# EAGLE schematic Arduino Micro DRAM Tester 3 (EAGLE 9.5.0)
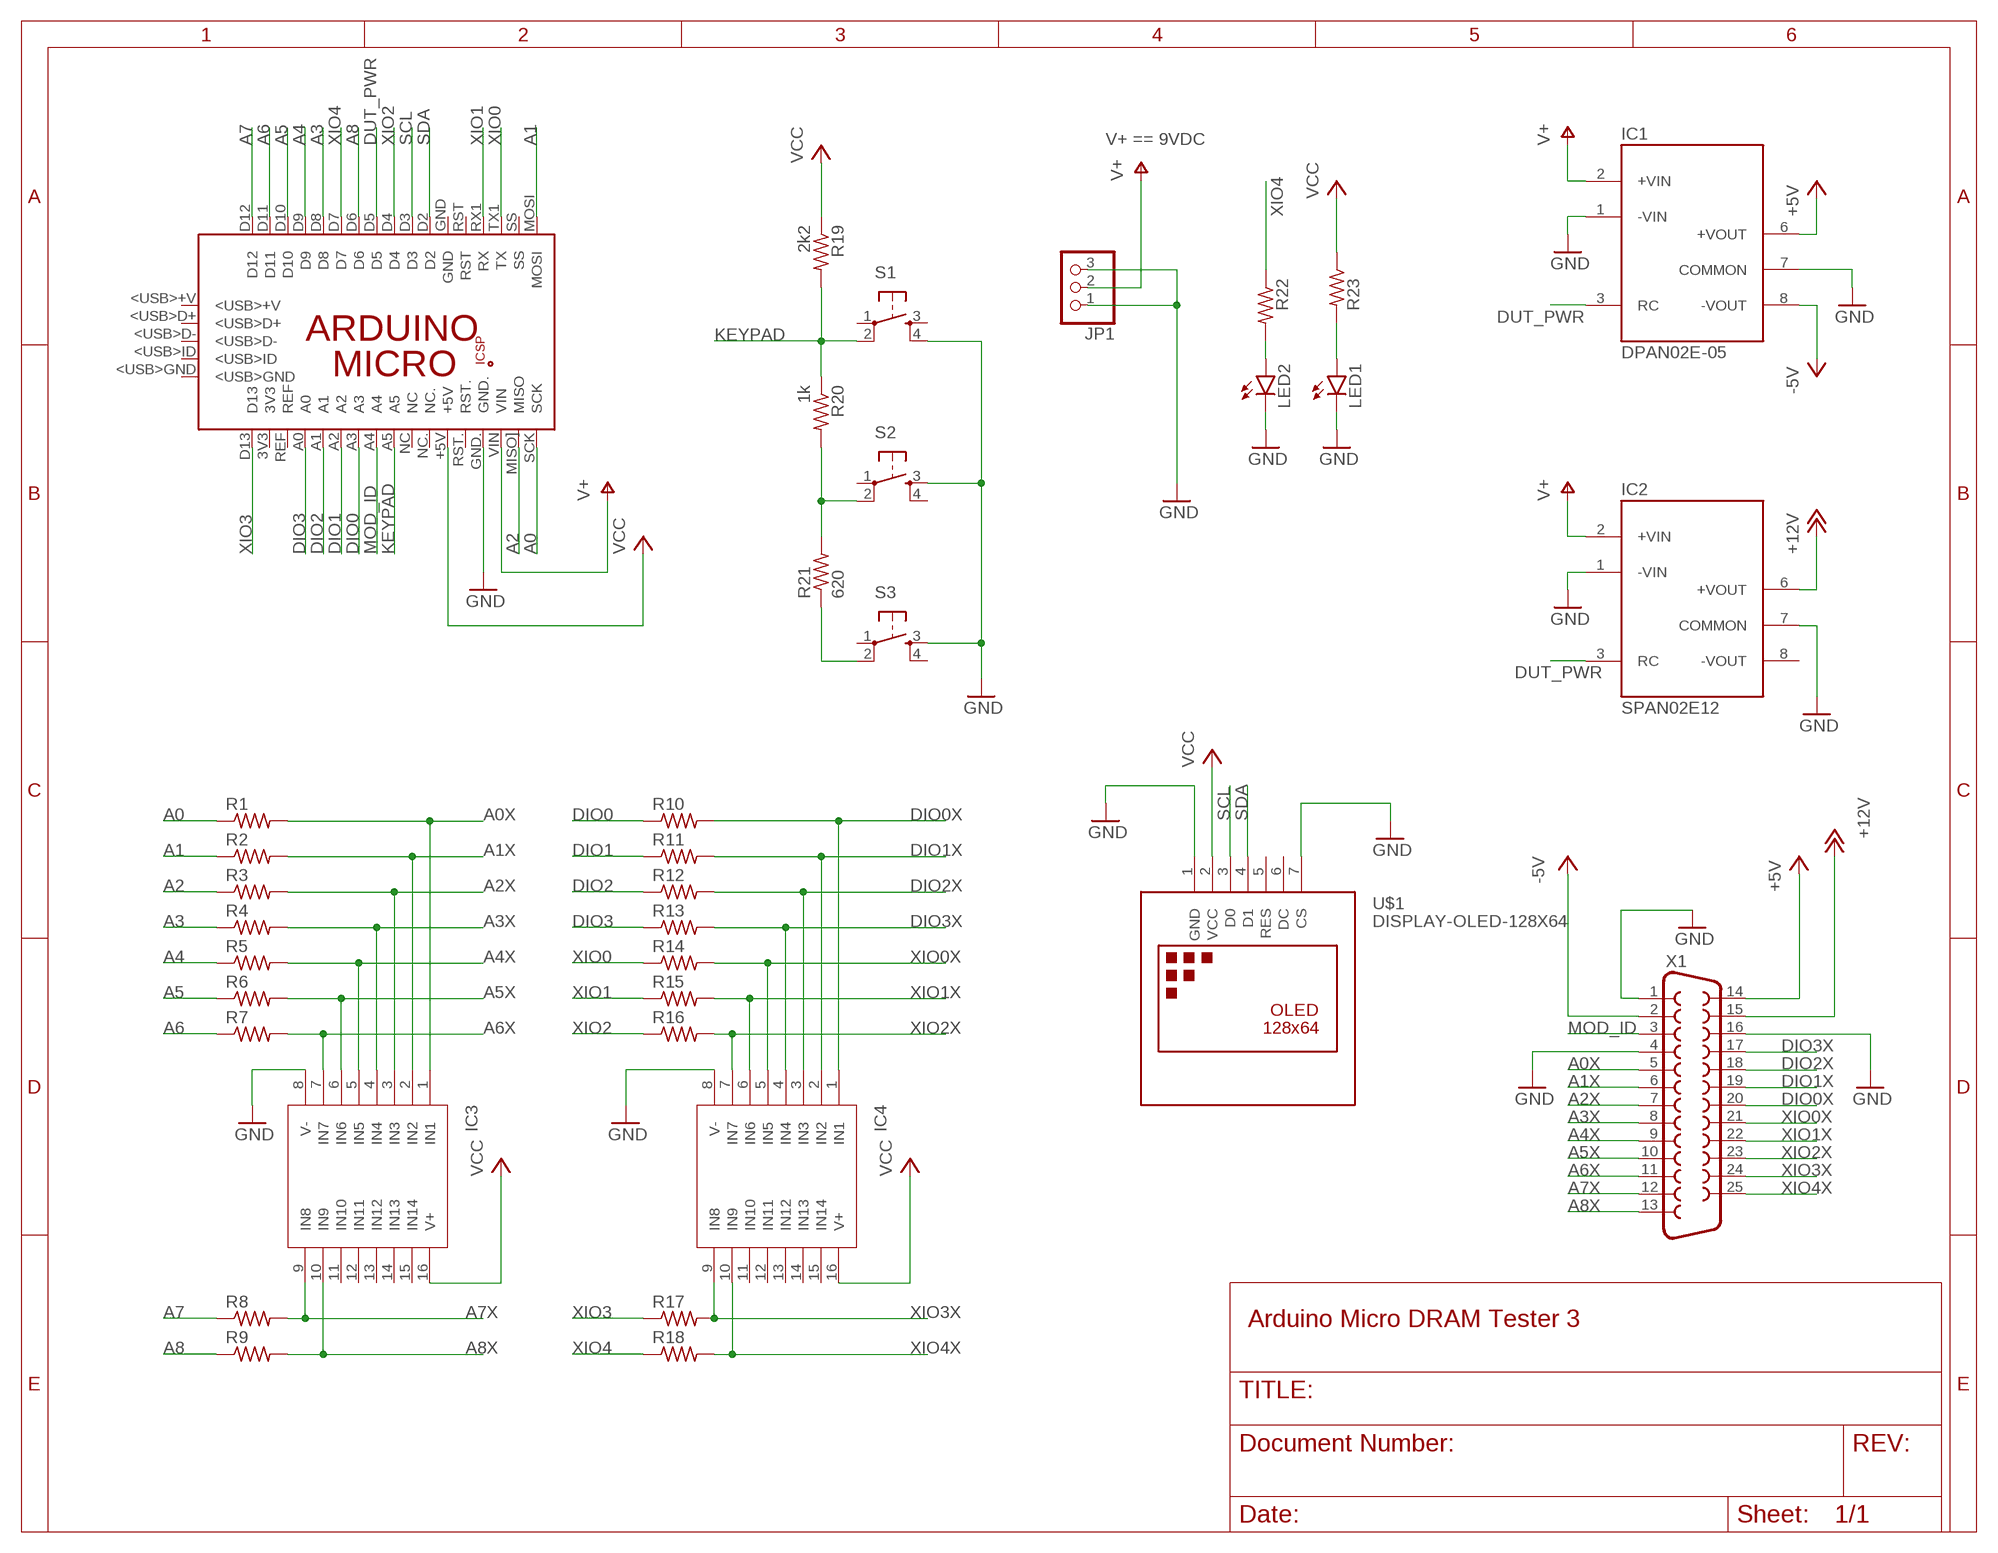
[diagram p0: schematic, sheet 1]

## Parts
IC1  DPAN02E-05  DPAN02  [SIP7]
IC2  SPAN02E12  DPAN02  [SIP7]
IC3  SP720  [DIL16]
IC4  SP720  [DIL16]
JP1  PINHD-1X3/90  [1X03/90]
LED1  LED5MM  [LED5MM]
LED2  LED5MM  [LED5MM]
PCB1  ARDUINO_MICRO  [ARDUINO_MICRO]
R1  R-US_0204/7  [0204/7]
R2  R-US_0204/7  [0204/7]
R3  R-US_0204/7  [0204/7]
R4  R-US_0204/7  [0204/7]
R5  R-US_0204/7  [0204/7]
R6  R-US_0204/7  [0204/7]
R7  R-US_0204/7  [0204/7]
R8  R-US_0204/7  [0204/7]
R9  R-US_0204/7  [0204/7]
R10  R-US_0204/7  [0204/7]
R11  R-US_0204/7  [0204/7]
R12  R-US_0204/7  [0204/7]
R13  R-US_0204/7  [0204/7]
R14  R-US_0204/7  [0204/7]
R15  R-US_0204/7  [0204/7]
R16  R-US_0204/7  [0204/7]
R17  R-US_0204/7  [0204/7]
R18  R-US_0204/7  [0204/7]
R19  2k2  R-US_0204/7  [0204/7]
R20  1k  R-US_0204/7  [0204/7]
R21  620  R-US_0204/7  [0204/7]
R22  R-US_0204/7  [0204/7]
R23  R-US_0204/7  [0204/7]
S1  TAC_SWITCHPTH  [TACTILE-PTH]
S2  TAC_SWITCHPTH  [TACTILE-PTH]
S3  TAC_SWITCHPTH  [TACTILE-PTH]
U$1  DISPLAY-OLED-128X64  [DISPLAY-OLED-128X64]
X1  F25D  [F25D]

## Nets
+5V: IC1.6(+VOUT) X1.14
+12V: IC2.6(+VOUT) X1.15
-5V: IC1.8(-VOUT) X1.2
A0: PCB1.SCK R1.1
A0X: IC3.1(IN1) R1.2 X1.5
A1: PCB1.MOSI R2.1
A1X: IC3.2(IN2) R2.2 X1.6
A2: PCB1.MISO](MISO) R3.1
A2X: IC3.3(IN3) R3.2 X1.7
A3: PCB1.D8 R4.1
A3X: IC3.4(IN4) R4.2 X1.8
A4: PCB1.D9 R5.1
A4X: IC3.5(IN5) R5.2 X1.9
A5: PCB1.D10 R6.1
A5X: IC3.6(IN6) R6.2 X1.10
A6: PCB1.D11 R7.1
A6X: IC3.7(IN7) R7.2 X1.11
A7: PCB1.D12 R8.1
A7X: IC3.9(IN8) R8.2 X1.12
A8: PCB1.D6 R9.1
A8X: IC3.10(IN9) R9.2 X1.13
DIO0: PCB1.A3 R10.1
DIO0X: IC4.1(IN1) R10.2 X1.20
DIO1: PCB1.A2 R11.1
DIO1X: IC4.2(IN2) R11.2 X1.19
DIO2: PCB1.A1 R12.1
DIO2X: IC4.3(IN3) R12.2 X1.18
DIO3: PCB1.A0 R13.1
DIO3X: IC4.4(IN4) R13.2 X1.17
DUT_PWR: IC1.3(RC) IC2.3(RC) PCB1.D5
GND: IC1.1(-VIN) IC1.7(COMMON) IC2.1(-VIN) IC2.7(COMMON) IC3.8(V-) IC4.8(V-) JP1.1 JP1.3 LED1.K(C) LED2.K(C) PCB1.GND. S1.4 S2.3 S3.3 U$1.1(GND) U$1.7(CS) X1.16
KEYPAD: PCB1.A5 R19.2 R20.1 S1.2
MOD_ID: PCB1.A4 X1.3
N$1: X1.1 ; supply symbol labelled GND
N$2: R20.2 R21.2 S2.2
N$3: R21.1 S3.2
N$6: LED1.A R23.2
N$7: X1.4 ; supply symbol labelled GND
N$20: LED2.A R22.2
SCL: PCB1.D3 U$1.3(D0)
SDA: PCB1.D2 U$1.4(D1)
V+: IC1.2(+VIN) IC2.2(+VIN) JP1.2 PCB1.VIN
VCC: IC3.16(V+) IC4.16(V+) PCB1.+5V R19.1 R23.1 U$1.2(VCC)
XIO0: PCB1.TX1(TX) R14.1
XIO0X: IC4.5(IN5) R14.2 X1.21
XIO1: PCB1.RX1(RX) R15.1
XIO1X: IC4.6(IN6) R15.2 X1.22
XIO2: PCB1.D4 R16.1
XIO2X: IC4.7(IN7) R16.2 X1.23
XIO3: PCB1.D13 R17.1
XIO3X: IC4.9(IN8) R17.2 X1.24
XIO4: PCB1.D7 R18.1 R22.1
XIO4X: IC4.10(IN9) R18.2 X1.25
Unconnected: IC2.8(-VOUT) IC3.11(IN10) IC3.12(IN11) IC3.13(IN12) IC3.14(IN13) IC3.15(IN14) IC4.11(IN10) IC4.12(IN11) IC4.13(IN12) IC4.14(IN13) IC4.15(IN14) PCB1.3V3 PCB1.5V PCB1.<USB>+V PCB1.<USB>D+ PCB1.<USB>D- PCB1.<USB>GND PCB1.<USB>ID PCB1.GND PCB1.GND_ PCB1.MISO. PCB1.MOSI. PCB1.NC PCB1.NC. PCB1.REF PCB1.RESET.. PCB1.RST PCB1.RST. PCB1.SCK. PCB1.SS S1.1 S1.3 S2.1 S2.4 S3.1 S3.4 U$1.5(RES) U$1.6(DC)

## Notes on the sheet
- V+ == 9VDC

## Library data of the parts
IC1 IC2 = MW DPAN02:DPAN02
IC3 IC4 = Littlefuse:SP720
JP1 = pinhead:PINHD-1X3: PIN HEADER
LED1 LED2 = led:LED: LED OSRAM: - CHIPLED LG R971, LG N971, LY N971, LG Q971, LY Q971, LO R971, LY R971 LH N974, LH R974 LS Q976, LO Q976, LY Q976 LO Q996 - Hyper CHIPLED LW Q18S LB Q993, LB Q99A, LB R99A - SideLED LS A670, LO A670, LY A670, LG A670, LP A670 LB A673, LV A673, LT A673, LW A673 LH A674 LY A675 LS A676, LA A676, LO A676, LY A676, LW A676 LS A679, LY A679, LG A679 - Hyper Micro SIDELED® LS Y876, LA Y876, LO Y876, LY Y876 LT Y87S - SmartLED LW L88C, LW L88S LB L89C, LB L89S, LG L890 LS L89K, LO L89K, LY L89K LS L896, LA L896, LO L896, LY L896 - TOPLED LS T670, LO T670, LY T670, LG T670, LP T670 LSG T670, LSP T670, LSY T670, LOP T670, LYG T670 LG T671, LOG T671, LSG T671 LB T673, LV T673, LT T673, LW T673 LH T674 LS T676, LA T676, LO T676, LY T676, LB T676, LH T676, LSB T676, LW T676 LB T67C, LV T67C, LT T67C, LS T67K, LO T67K, LY T67K, LW E67C LS E67B, LA E67B, LO E67B, LY E67B, LB E67C, LV E67C, LT E67C LW T67C LS T679, LY T679, LG T679 LS T770, LO T770, LY T770, LG T770, LP T770 LB T773, LV T773, LT T773, LW T773 LH T774 LS E675, LA E675, LY E675, LS T675 LS T776, LA T776, LO T776, LY T776, LB T776 LHGB T686 LT T68C, LB T68C - Hyper Mini TOPLED® LB M676 - Mini TOPLED Santana® LG M470 LS M47K, LO M47K, LY M47K Source: http://www.osram.convergy.de LUXEON: - LUMILED® LXK2-PW12-R00, LXK2-PW12-S00, LXK2-PW14-U00, LXK2-PW14-V00 LXK2-PM12-R00, LXK2-PM12-S00, LXK2-PM14-U00 LXK2-PE12-Q00, LXK2-PE12-R00, LXK2-PE12-S00, LXK2-PE14-T00, LXK2-PE14-U00 LXK2-PB12-K00, LXK2-PB12-L00, LXK2-PB12-M00, LXK2-PB14-N00, LXK2-PB14-P00, LXK2-PB14-Q00 LXK2-PR12-L00, LXK2-PR12-M00, LXK2-PR14-Q00, LXK2-PR14-R00 LXK2-PD12-Q00, LXK2-PD12-R00, LXK2-PD12-S00 LXK2-PH12-R00, LXK2-PH12-S00 LXK2-PL12-P00, LXK2-PL12-Q00, LXK2-PL12-R00 Source: www.luxeon.com KINGBRIGHT: KA-3528ASYC Source: www.kingbright.com
PCB1 = E14_Arduino_revC:ARDUINO_MICRO: Device for representing an Arduino Micro board with a footprint in an EAGLE design. Created by Dave Young for Element14. More EAGLE documentation at: http://www.element14.com/community/community/knode/cadsoft_eagle
R1-R23 = resistor:R-US_: RESISTOR, American symbol
S1-S3 = SparkFun-Electromechanical:TAC_SWITCH: Momentary Switch Button commonly used for reset or general input. Spark Fun Electronics SKU : COM-00097 SMT- SWCH-08247
U$1 = diy-modules:DISPLAY-OLED-128X64: 128x64 Dot Matrix OLED Module based on SSD1306 chip Variant with SPI interface More details available here: http://www.instructables.com/id/How-to-use-OLED-display-arduino-module/ SSD1306 datasheet: https://cdn-shop.adafruit.com/datasheets/SSD1306.pdf Click here to find device on ebay.com <http://www.ebay.com/sch/oled+display+128x64> Note: There are two variants: I2C and SPI. Search for the proper version.
X1 = con-subd:F25: SUB-D; OC_FARNELL: unknown; OC_NEWARK: unknown